# EAGLE schematic SCFschem (EAGLE 8.3.1)
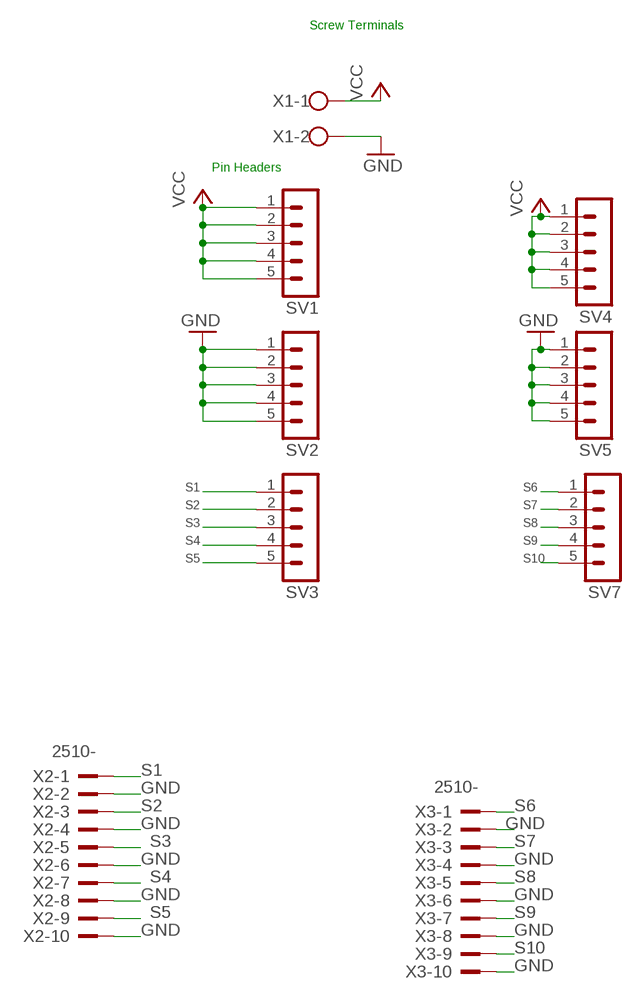
[diagram p0: schematic, sheet 1]

## Parts
SV1  MA05-1  [MA05-1]
SV2  MA05-1  [MA05-1]
SV3  MA05-1  [MA05-1]
SV4  MA05-1  [MA05-1]
SV5  MA05-1  [MA05-1]
SV7  MA05-1  [MA05-1]
X1  1X02_5MM_SCREW  [W237-102]
X2  2510-  [PAK100/2500-10]
X3  2510-  [PAK100/2500-10]

## Nets
GND: SV2.1 SV2.2 SV2.3 SV2.4 SV2.5 SV5.1 SV5.2 SV5.3 SV5.4 SV5.5 X1.2 X2.2 X2.4 X2.6 X2.8 X2.10 X3.2 X3.4 X3.6 X3.8 X3.10
S1: SV3.1 X2.1
S2: SV3.2 X2.3
S3: SV3.3 X2.5
S4: SV3.4 X2.7
S5: SV3.5 X2.9
S6: SV7.1 X3.1
S7: SV7.2 X3.3
S8: SV7.3 X3.5
S9: SV7.4 X3.7
S10: SV7.5 X3.9
VCC: SV1.1 SV1.2 SV1.3 SV1.4 SV1.5 SV4.1 SV4.2 SV4.3 SV4.4 SV4.5 X1.1

## Notes on the sheet
- Screw Terminals
- Pin Headers

## Library data of the parts
SV1-SV5 SV7 = con-lstb:MA05-1: PIN HEADER; OC_FARNELL: unknown; OC_NEWARK: unknown
X1 = ECE388:1X02_5MM_SCREW: WAGO SCREW CLAMP; MPN: 237-102; OC_FARNELL: unknown; OC_NEWARK: 70K9898
X2 X3 = con-3m:2510-: 3M (TM) Pak 100 4-Wall Header Source: 3M; MF: 3M; MPN: 2510-6002UB; OC_FARNELL: 9838244; OC_NEWARK: 46F4725